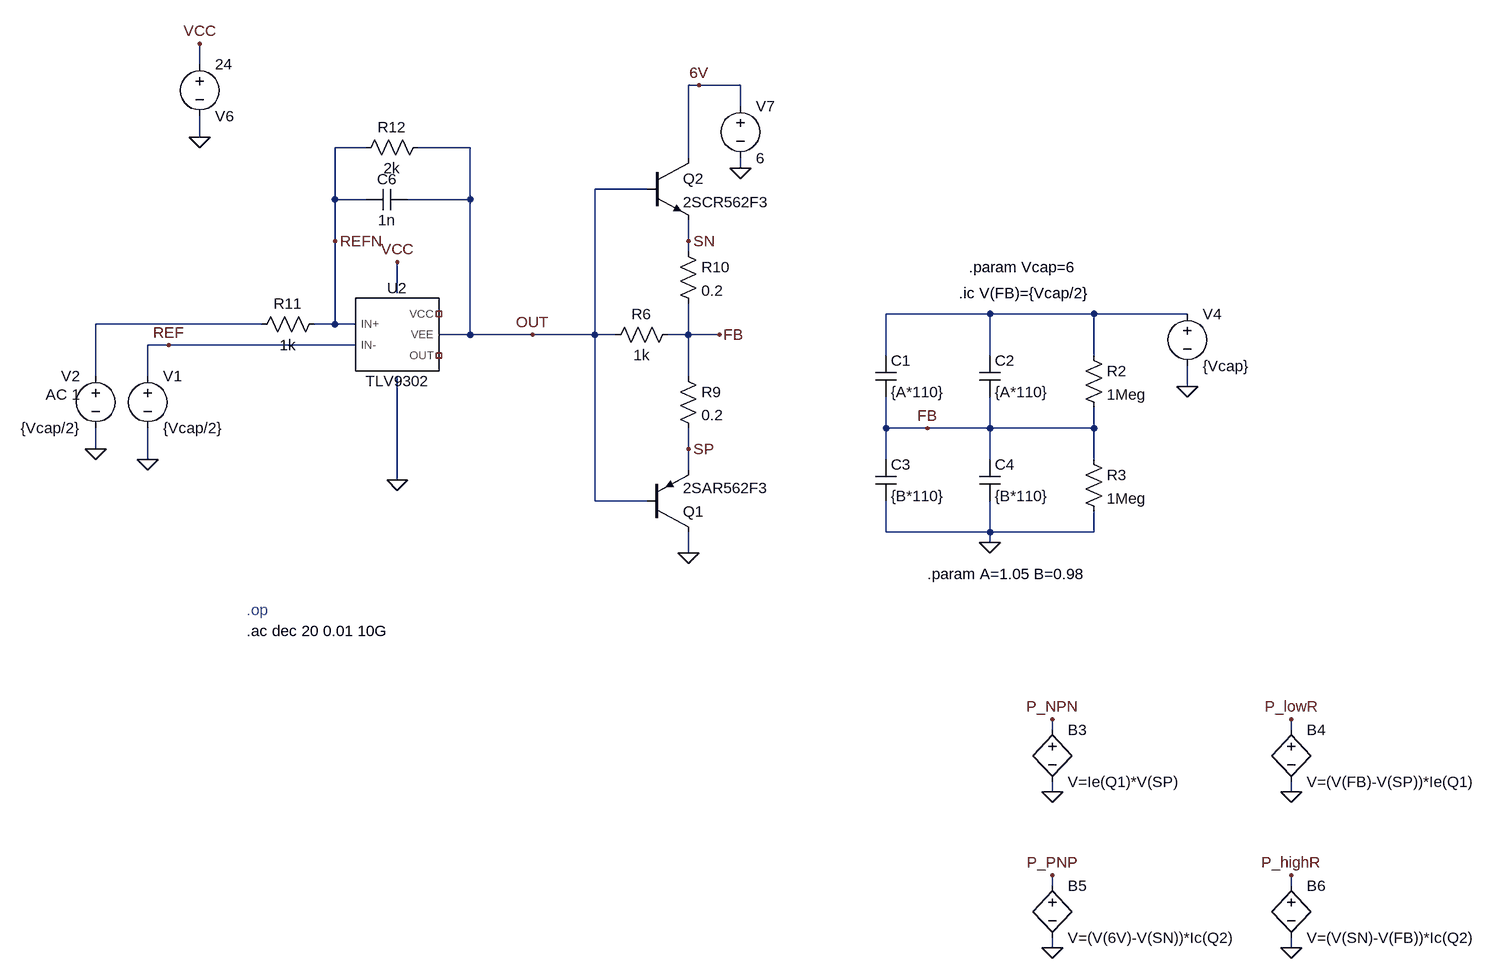
[diagram p0: schematic stack_balancing_stab.asc]
stack_balancing_stab.asc, the LTspice schematic file:
Version 4
SHEET 1 1476 772
WIRE -1888 -608 -1888 -640
WIRE -1120 -576 -1136 -576
WIRE -1056 -576 -1120 -576
WIRE -1056 -544 -1056 -576
WIRE -1888 -496 -1888 -528
WIRE -1632 -480 -1680 -480
WIRE -1472 -480 -1552 -480
WIRE -1136 -464 -1136 -576
WIRE -1056 -448 -1056 -464
WIRE -1200 -416 -1280 -416
WIRE -1680 -400 -1680 -480
WIRE -1632 -400 -1680 -400
WIRE -1472 -400 -1472 -480
WIRE -1472 -400 -1568 -400
WIRE -1680 -336 -1680 -400
WIRE -1136 -336 -1136 -368
WIRE -1136 -320 -1136 -336
WIRE -1584 -256 -1584 -304
WIRE -672 -224 -832 -224
WIRE -512 -224 -672 -224
WIRE -368 -224 -512 -224
WIRE -1792 -208 -2048 -208
WIRE -1680 -208 -1680 -336
WIRE -1680 -208 -1712 -208
WIRE -1648 -208 -1680 -208
WIRE -1472 -192 -1472 -400
WIRE -1472 -192 -1520 -192
WIRE -1376 -192 -1472 -192
WIRE -1280 -192 -1280 -416
WIRE -1280 -192 -1376 -192
WIRE -1248 -192 -1280 -192
WIRE -1136 -192 -1136 -240
WIRE -1136 -192 -1168 -192
WIRE -1088 -192 -1136 -192
WIRE -1936 -176 -1968 -176
WIRE -1648 -176 -1936 -176
WIRE -832 -160 -832 -224
WIRE -672 -160 -672 -224
WIRE -512 -160 -512 -224
WIRE -2048 -128 -2048 -208
WIRE -1968 -128 -1968 -176
WIRE -1136 -128 -1136 -192
WIRE -368 -112 -368 -144
WIRE -832 -48 -832 -96
WIRE -768 -48 -832 -48
WIRE -672 -48 -672 -96
WIRE -672 -48 -768 -48
WIRE -512 -48 -512 -80
WIRE -512 -48 -672 -48
WIRE -2048 -16 -2048 -48
WIRE -1136 -16 -1136 -48
WIRE -1968 0 -1968 -48
WIRE -832 0 -832 -48
WIRE -672 0 -672 -48
WIRE -512 0 -512 -48
WIRE -1136 16 -1136 -16
WIRE -1584 32 -1584 -128
WIRE -1280 64 -1280 -192
WIRE -1200 64 -1280 64
WIRE -832 112 -832 64
WIRE -672 112 -672 64
WIRE -672 112 -832 112
WIRE -512 112 -512 80
WIRE -512 112 -672 112
WIRE -672 128 -672 112
WIRE -1136 144 -1136 112
WIRE -576 416 -576 400
WIRE -208 416 -208 400
WIRE -576 512 -576 496
WIRE -208 512 -208 496
WIRE -576 656 -576 640
WIRE -208 656 -208 640
WIRE -576 752 -576 736
WIRE -208 752 -208 736
FLAG -576 512 0
FLAG -576 400 P_NPN
FLAG -208 512 0
FLAG -208 400 P_lowR
FLAG -576 752 0
FLAG -576 640 P_PNP
FLAG -208 752 0
FLAG -208 640 P_highR
FLAG -672 128 0
FLAG -768 -48 FB
FLAG -368 -112 0
FLAG -1888 -496 0
FLAG -1584 32 0
FLAG -1088 -192 FB
FLAG -1936 -176 REF
FLAG -1888 -640 VCC
FLAG -1584 -304 VCC
FLAG -1376 -192 OUT
FLAG -1136 144 0
FLAG -1136 -336 SN
FLAG -1136 -16 SP
FLAG -1056 -448 0
FLAG -1120 -576 6V
FLAG -1680 -336 REFN
FLAG -1968 0 0
FLAG -2048 -16 0
DATAFLAG -1488 -480 ""
SYMBOL bv -576 400 R0
SYMATTR InstName B3
SYMATTR Value V=Ie(Q1)*V(SP)
SYMBOL bv -208 400 R0
SYMATTR InstName B4
SYMATTR Value V=(V(FB)-V(SP))*Ie(Q1)
SYMBOL bv -576 640 R0
SYMATTR InstName B5
SYMATTR Value V=(V(6V)-V(SN))*Ic(Q2)
SYMBOL bv -208 640 R0
SYMATTR InstName B6
SYMATTR Value V=(V(SN)-V(FB))*Ic(Q2)
SYMBOL cap -848 -160 R0
SYMATTR InstName C1
SYMATTR Value {A*110}
SYMATTR SpiceLine Rser=18m
SYMBOL cap -688 -160 R0
SYMATTR InstName C2
SYMATTR Value {A*110}
SYMATTR SpiceLine Rser=18m
SYMBOL cap -848 0 R0
SYMATTR InstName C3
SYMATTR Value {B*110}
SYMATTR SpiceLine Rser=18m
SYMBOL cap -688 0 R0
SYMATTR InstName C4
SYMATTR Value {B*110}
SYMATTR SpiceLine Rser=18m
SYMBOL res -528 -176 R0
SYMATTR InstName R2
SYMATTR Value 1Meg
SYMBOL res -528 -16 R0
SYMATTR InstName R3
SYMATTR Value 1Meg
SYMBOL voltage -368 -240 R0
WINDOW 123 0 0 Left 0
WINDOW 39 0 0 Left 0
SYMATTR InstName V4
SYMATTR Value {Vcap}
SYMBOL voltage -1888 -624 R0
WINDOW 0 24 96 Left 2
WINDOW 3 24 16 Left 2
WINDOW 123 0 0 Left 0
WINDOW 39 0 0 Left 0
SYMATTR InstName V6
SYMATTR Value 24
SYMBOL res -1152 -208 R90
WINDOW 0 0 56 VBottom 2
WINDOW 3 32 56 VTop 2
SYMATTR InstName R6
SYMATTR Value 1k
SYMBOL res -1152 -144 R0
SYMATTR InstName R9
SYMATTR Value 0.2
SYMBOL res -1152 -336 R0
SYMATTR InstName R10
SYMATTR Value 0.2
SYMBOL TLV9302 -1584 -192 R0
SYMATTR InstName U2
SYMBOL voltage -1056 -560 R0
WINDOW 123 0 0 Left 0
WINDOW 39 0 0 Left 0
SYMATTR InstName V7
SYMATTR Value 6
SYMBOL res -1696 -224 R90
WINDOW 0 0 56 VBottom 2
WINDOW 3 32 56 VTop 2
SYMATTR InstName R11
SYMATTR Value 1k
SYMBOL res -1536 -496 R90
WINDOW 0 0 56 VBottom 2
WINDOW 3 32 56 VTop 2
SYMATTR InstName R12
SYMATTR Value 2k
SYMBOL cap -1568 -416 R90
WINDOW 0 0 32 VBottom 2
WINDOW 3 32 32 VTop 2
SYMATTR InstName C6
SYMATTR Value 1n
SYMBOL voltage -1968 -144 R0
WINDOW 123 0 0 Left 0
WINDOW 39 0 0 Left 0
SYMATTR InstName V1
SYMATTR Value {Vcap/2}
SYMBOL pnp -1200 112 M180
SYMATTR InstName Q1
SYMATTR Value 2SAR562F3
SYMBOL npn -1200 -464 R0
SYMATTR InstName Q2
SYMATTR Value 2SCR562F3
SYMBOL voltage -2048 -144 M0
WINDOW 123 24 44 Left 2
WINDOW 39 0 0 Left 0
SYMATTR Value2 AC 1
SYMATTR InstName V2
SYMATTR Value {Vcap/2}
TEXT -1816 232 Left 2 ;.op
TEXT -1816 264 Left 2 !.ac dec 20 0.01 10G
TEXT -768 176 Left 2 !.param A=1.05 B=0.98
TEXT -720 -256 Left 2 !.ic V(FB)={Vcap/2}
TEXT -704 -296 Left 2 !.param Vcap=6

The netlist it stands for:
* stack_balancing_stab.asc
B3 P_NPN 0 V=Ie(Q1)*V(SP)
B4 P_lowR 0 V=(V(FB)-V(SP))*Ie(Q1)
B5 P_PNP 0 V=(V(6V)-V(SN))*Ic(Q2)
B6 P_highR 0 V=(V(SN)-V(FB))*Ic(Q2)
C1 N001 FB {A*110} Rser=18m
C2 N001 FB {A*110} Rser=18m
C3 FB 0 {B*110} Rser=18m
C4 FB 0 {B*110} Rser=18m
R2 N001 FB 1Meg
R3 FB 0 1Meg
V4 N001 0 {Vcap}
V6 VCC 0 24
R6 FB OUT 1k
R9 FB SP 0.2
R10 SN FB 0.2
XU2 REFN REF NC_01 OUT NC_02 TLV9302  ; pins IN+ IN- VCC VEE OUT
V7 6V 0 6
R11 REFN N002 1k
R12 OUT REFN 2k
C6 OUT REFN 1n
V1 REF 0 {Vcap/2}
Q1 0 OUT SP 0 2SAR562F3
Q2 6V OUT SN 0 2SCR562F3
V2 N002 0 {Vcap/2} AC 1
.model NPN NPN
.model PNP PNP
.lib standard.bjt
* .op
.ac dec 20 0.01 10G
.param A=1.05 B=0.98
.ic V(FB)={Vcap/2}
.param Vcap=6
.lib .\libraries\tlv9302.lib
.backanno
.end